# Altium schematic sheet IDEAL_DIODE_1.SchDoc
size A; SheetNumber: 4; SheetTotal: 10
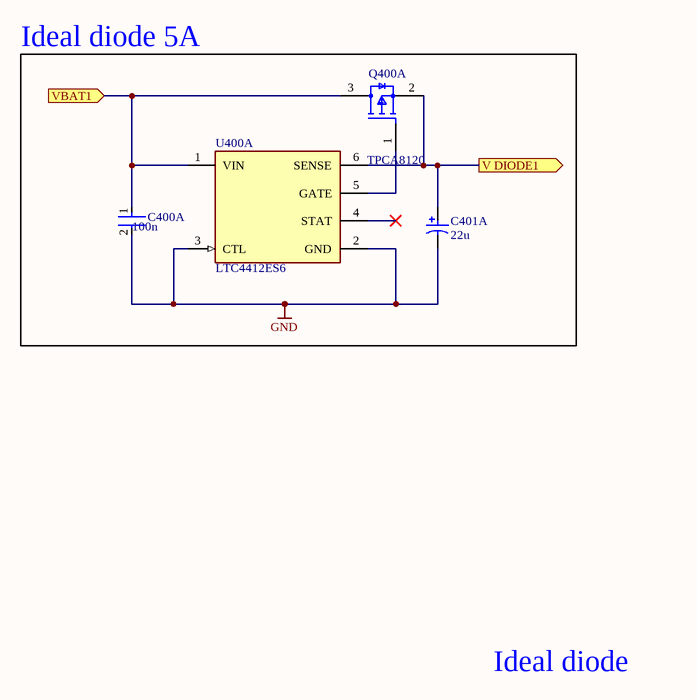
[diagram p0: IDEAL_DIODE_1.SchDoc]

## Parts
C400A  100n  [FP-0603-L_1_6_0_15-W_0_81-IPC_A]
C401A  22u  [KEMT-T491-B_L]
Q400A  TPCA8120  [FP-527AG-MFG]
U400A  LTC4412ES6  [FP-S6-6-05-08-1636-IPC_C]

## Blocks framed on the sheet
Ideal diode 5A: C400A C401A Q400A U400A

## Ports
V DIODE1 (out), VBAT1 (in, see 3[3A], 5[4B])

## Nets
GND: C400A.2 C401A.2 U400A.2(GND) U400A.3(CTL)
V DIODE1: C401A.1 Q400A.2(S) U400A.6(SENSE) ; port V DIODE1
VBAT1: C400A.1 Q400A.3(D) U400A.1(VIN) ; port VBAT1
NetQ400A_1: Q400A.1(G) U400A.5(GATE)

Not connected (* = marked no-connect by the designer): U400A 4(STAT)*

## Notes on the sheet
- Ideal diode

## Library data of the parts
C400A = CMP-2006-04386-2: Automotive Ceramic Capacitor, 0603, 100nF, 10%, X7R, 15%, 50V; Dissipation Factor: 2.5%; Insulation Resistance: 100GR; Package Quantity: 1; Radiation Hardening: No; Contact Plating: Tin; Width: 0.032inch; Voltage Rating (DC): 50V; Dielectric Material: Ceramic; Length: 1.6mm; Thickness: 0.035inch; Min Operating Temperature: -55°C; Voltage: 50V; Depth: 0.81mm; Max Operating Temperature: 125°C; Series: -; Dielectric: X7R; Tolerance: 10%; Mount: Surface Mount; Termination: SMD/SMT; Ratings: AEC-Q200; Lead Free: Lead Free; Case Code (Imperial): 0603; Case/Package: 0603; Voltage Rating: 50V; Case Code (Metric): 1608; Capacitance: 100nF; RoHS Compliant: Yes; Number of Pins: 2; REACH SVHC: No SVHC; Construction: Flat; Height: 0.9mm; Packaging: Tape and Reel
C401A = CMP-2000-07193-1: Tantalum Capacitor, 22 uF, +/- 10%, 10 V, -55 to 125 degC, 2-Pin SMD, RoHS, Tape and Reel; Manufacturer: Kemet; Lead Spacing (nom): NotRequiredmm; Polarity: Polar; Insulation: NotRequired; Voltage: 10VDC; DCL: 2.2uA; ESR: 2.4ohm; Rad Hardened: No; Capacitance: 22000000pF; Product Length (mm): 3.5mm; Case Style: Molded; Product Depth (mm): 2.8mm; DF: 6%; Product Height (mm): 1.9mm; Seated Plane Height: NotRequiredmm; Failure Rate: NotRequired; Datasheet URL: http://capacitoredge.kemet.com/capedge2/DataSheet/Datasheet-T491B226K010AT.pdf?pn=T491B226K010AT; Mounting Technology: SurfaceMount; Datasheet Version: 10/2016; Construction: SMTChip; Package Reference: T491-B; Product Diameter (mm): NotRequiredmm; Operating Temp Range: -55Cto125C; Manufacturer URL: http://www.kemet.com/; Wire Form: NotRequired; Tolerance (+ or -): 10%; Case Code: B; Packaging: TapeandReel; Length W/Weld: NotRequiredmm; Package Description: 2-Pin Surface Mount Device, Body 3.5 x 2.8 mm; Length W/Weld (max): NotRequiredmm; Seal: NotRequired; Mounting Style: SurfaceMount; Package / Case: 3528-21
Q400A = CMP-2100-03638-2: MOSFET P-CH 20V 2A SSOT3; Fall Time: 11ns; Rise Time: 9ns; Voltage Rating (DC): -20V; Power Dissipation: 500mW; Nominal Vgs: -800mV; Current Rating: -2A; Gate to Source Voltage (Vgs): 8V; Rds On Max: 70mR; Turn-Off Delay Time: 27ns; Element Configuration: Single; Number of Elements: 1; Input Capacitance: 779pF; Drain to Source Resistance: 60mR; Turn-On Delay Time: 10ns; Package Quantity: 1; Mount: Surface Mount; Case/Package: SOT-23; Min Operating Temperature: -55°C; REACH SVHC: No SVHC; Weight: 0.03g; Packaging: Tape and Reel; Threshold Voltage: -800mV; Max Operating Temperature: 150°C; Dual Supply Voltage: -20V; Termination: SMD/SMT; Drain to Source Voltage (Vdss): 20V; Height: 0.94mm; Length: 2.92mm; Contact Plating: Tin; Width: 3.05mm; Drain to Source Breakdown Voltage: -20V; Max Power Dissipation: 500mW; Continuous Drain Current (ID): 2A; Number of Pins: 3; Lead Free: Lead Free; Radiation Hardening: No; On-State Resistance: 70MR
U400A = CMP-0479-00425-2: IC OR CTRLR SRC SELECT TSOT23-6; Min Supply Voltage: 2.5V; Max Supply Voltage: 28V; Turn-On Delay Time: 110us; Number of Channels: 1; Lead Free: Lead Free; Length: 2.9mm; Radiation Hardening: No; RoHS Compliant: Yes; Package Quantity: 1; Min Operating Temperature: -40°C; Series: PowerPath™; Packaging: Tape and Reel; Width: 1.75mm; Height: 0.9mm; Number of Pins: 6; Max Operating Temperature: 85°C; Number of Outputs: 1; Case/Package: TSOT; REACH SVHC: No SVHC